# Altium schematic sheet Respiration Sensor.SchDoc
size A4; SPICEModelCacheCCUCSNMB: <root> / <DocumentId>CCUCSNMB</DocumentId> / <CacheFrame Number="0"> / <Model Name="cap" Kind="MDL"> / <Text>*Default semiconductor capacitor / .MODEL CAP C()</Text> / </Model> / <Model Name="1n4004" Kind="MDL"> / <Text>*1N4004 MCE 8-16-95 / *400V 1A Si GenPurpose Diode pkg:DIODE0.4 1,2 / .MODEL 1N4004 D(IS=2.55E-9 RS=0.042 N=1.75 TT=5.76E-6 CJO=1.85E-11 / + VJ=0.75 M=0.333 BV=400 IBV=3.95E-5 )</Text> / </Model> / <Model Name="led3" Kind="MDL"> / <Text>*Typ BLUE SiC LED: Vf=3.4V Vr=5V If=40mA trr=3uS / *LED Pinout: 1=A, 2=K / .MODEL LED3 D (IS=93.1P RS=42M N=7.47 BV=5 IBV=30U / + CJO=2.97P VJ=.75 M=.333 TT=4.32U)</Text> / </Model> / </CacheFrame> / </root>
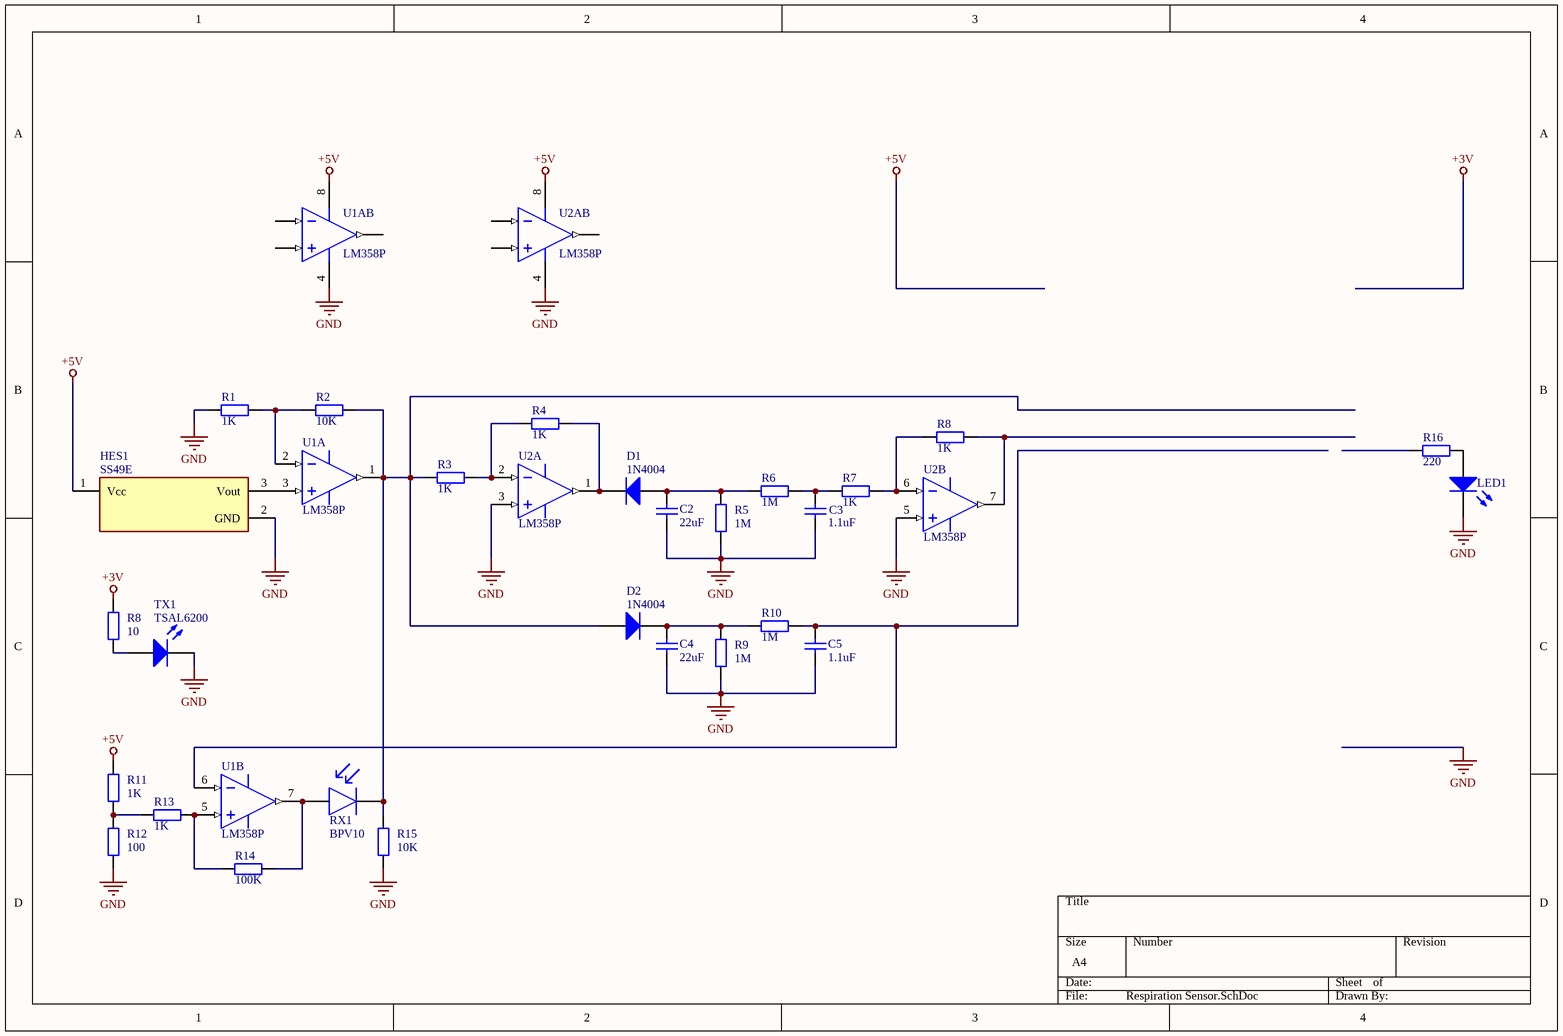
[diagram p0: Respiration Sensor.SchDoc]

## Parts
(Parts that share a designator on the sheet are numbered #1, #2 ... from top to bottom, then left to right.)
C2  value 22uF  [RAD-0.3]  (hidden comment: Cap)
C3  value 1.1uF  [RAD-0.3]  (hidden comment: Cap)
C4  value 22uF  [RAD-0.3]  (hidden comment: Cap)
C5  value 1.1uF  [RAD-0.3]  (hidden comment: Cap)
D1  1N4004  [DO-41]
D2  1N4004  [DO-41]
HES1  SS49E  [FP-SS49E-MFG]
LED1  LED3  [3.5X2.8X1.9]  (value not drawn)
R1  1K  [AXIAL-0.4]
R2  10K  [AXIAL-0.4]
R3  1K  [AXIAL-0.4]
R4  1K  [AXIAL-0.4]
R5  1M  [AXIAL-0.4]
R6  1M  [AXIAL-0.4]
R7  1K  [AXIAL-0.4]
R8#1  1K  [AXIAL-0.4]
R8#2  10  [AXIAL-0.4]
R9  1M  [AXIAL-0.4]
R10  1M  [AXIAL-0.4]
R11  1K  [AXIAL-0.4]
R12  100  [AXIAL-0.4]
R13  1K  [AXIAL-0.4]
R14  100K  [AXIAL-0.4]
R15  10K  [AXIAL-0.4]
R16  220  [AXIAL-0.4]
RX1  BPV10  [FP-6_544-5185_02-4-MFG]
TX1  TSAL6200  [VISH-TSAL6200]
U1  LM358P  [P0008A]  (parts A,B of 2)
U1A  LM358P  [P0008A]  (part B of 2)
U2  LM358P  [P0008A]  (parts A,B of 2)
U2A  LM358P  [P0008A]  (part B of 2)

## Nets
+3V: R8#2.2
+5V: HES1.1(Vcc) R11.2 U1A.8(VCC) U2A.8(VCC)
GND: C2.1 C3.1 C4.1 C5.1 HES1.2(GND) LED1.2(K) R1.1 R5.1 R9.1 R12.1 R15.1 TX1.2(K) U1A.4(GND) U2.3(1IN+) U2.5(2IN+) U2A.4(GND)
NetC2_2: C2.2 D1.1(A) R5.2 R6.1
NetC3_2: C3.2 R6.2 R7.1
NetC4_2: C4.2 D2.2(K) R9.2 R10.1
NetC5_2: C5.2 R10.2 U1.6(2IN-)
NetD1_2: D1.2(K) R4.2 U2.1(1OUT)
NetD2_1: D2.1(A) R2.2 R3.1 R15.2 RX1.1(C) U1.1(1OUT)
NetHES1_3: HES1.3(Vout) U1.3(1IN+)
NetLED1_1: LED1.1(A) R16.2
NetR1_2: R1.2 R2.1 U1.2(1IN-)
NetR3_2: R3.2 R4.1 U2.2(1IN-)
NetR7_2: R7.2 R8#1.1 U2.6(2IN-)
NetR8#1_2: R8#1.2 U2.7(2OUT)
NetR8#2_1: R8#2.1 TX1.1(A)
NetR11_1: R11.1 R12.2 R13.1
NetR13_2: R13.2 R14.1 U1.5(2IN+)
NetR14_2: R14.2 RX1.2(A) U1.7(2OUT)

Not connected (* = marked no-connect by the designer): R16 1; U1A 5(2IN+) 6(2IN-) 7(2OUT); U2A 5(2IN+) 6(2IN-) 7(2OUT)

## Library data of the parts
C2-C5 = Cap: Capacitor; Published: 8-Jun-2000; LatestRevisionDate: 17-Jul-2002; LatestRevisionNote: Re-released for DXP Platform.; PackageReference: RAD-0.3; Publisher: Altium Limited; PackageDescription: Radial Cap, Thru-Hole; 2 Leads; 0.3 in Pin Spacing
D1 D2 = Diode 1N4004: 1 Amp General Purpose Rectifier; Published: 8-Jun-2000; LatestRevisionDate: 17-Jul-2002; LatestRevisionNote: Re-released for DXP Platform.; DatasheetVersion: 1998; PackageVersion: Aug-1999; PackageReference: DO-41; Publisher: Altium Limited; PackageDescription: Diode, Axial; Body 5.2 x 2.7 mm (LxDia. max), Lead Dia. 0.86 mm (max); Code_JEDEC: DO-204-AL; ComponentLink1Description: Manufacturer Link; ComponentLink1URL: http://www.fairchildsemi.com/; ComponentLink2Description: Datasheet; ComponentLink2URL: http://www.fairchildsemi.com/ds/1N%2F1N4001.pdf
HES1 = CMP-11168-000005-1: SENSOR LINEAR ANALOG RADIAL; Min Supply Voltage: 2.7V; Switching Current: 1.5mA; Input Current: 10mA; Min Supply Voltage (DC): 4V; Max Supply Voltage: 6.5V; Operating Supply Current: 6mA; Output Voltage: 1.75mV; Max Supply Voltage (DC): 10V; Leakage Current: 10uA; Response Time: 3us; Package Quantity: 1000; Output Type: Analog; Output Current: 1.5mA; Radiation Hardening: No; Termination: PC Pin; Series: SS49E; RoHS Compliant: Yes; Type: Integrated Circuit (IC); Lead Free: Lead Free; Width: 1.6mm; Length: 4.1mm; Nominal Supply Current: 10mA; Max Operating Temperature: 150°C; Max Output Current: 10mA; Mount: Through Hole; Packaging: Bulk; Case/Package: TO-226-3; Min Operating Temperature: -40°C; Height: 4.1mm; Number of Pins: 3
LED1 = LED3: Typical BLUE SiC LED; Published: 8-Jun-2000; LatestRevisionDate: 17-Dec-2003; LatestRevisionNote: PCB Footprint replaced.; DatasheetVersion: 16-Apr-2002; PackageVersion: 16-Apr-2002; PackageReference: 3.5X2.8X1.9; Publisher: Altium Limited; PackageDescription: SM LED; 2 C-Bend Leads; Body 3.5 x 2.8 x 1.9 mm, inc leads (LxWxH typ)
R1-R7 R8#1 R8#2 R9-R16 = Res2: Resistor; Published: 8-Jun-2000; LatestRevisionDate: 17-Jul-2002; LatestRevisionNote: Re-released for DXP Platform.; PackageReference: AXIAL-0.4; Publisher: Altium Limited; PackageDescription: Axial Device, Thru-Hole; 2 Leads; 0.4 in Pin Spacing
RX1 = CMP-02531-000005-1: SENSOR PHOTODIODE 940NM RADIAL; Manufacturer: Vishay; Standoff Height: 2.6mm; Wavelength: 920nm; Response Time: 2.5ns; Power Dissipation: 215mW; Reverse Breakdown Voltage: 60V; Forward Voltage: 1V; Viewing Angle: 40°; Forward Current: 50mA; Dark Current: 0.001uA; Max Junction Temp: +100°C; Device Class L3: Photodiodes; Manufacturer Part Number: BPV10; RoHS: TRUE; Digikey Description: SENSOR PHOTODIODE 940NM RADIAL; Device Class L1: Sensors; Package: 6.544-5185.02-4; Temperature Range High: +100°C; Sensor Output: Photodiode; Temperature Range Low: -40°C; Height: 12.1mm; Lead Free: Yes; Automotive: No; ComponentLink2Description: Datasheet; Device Class L2: Optical Sensors; ComponentLink2URL: http://www.vishay.com/docs/81502/bpv10.pdf; Octopart: https://octopart.com/bpv10-vishay-39728465; Ambient Temperature Range Low: -40°C; Category: Diode; Temperature: -40°C to +100°C; Mouser Description: Photodiodes 10V 215mW 875nm; Ambient Temperature Range High: +100°C
TX1 = CMP-2000-07327-1: High Power Infrared Emitting Diode, GaAlAs, MQW, 1.35 V, 100 mA, -40 to 85 degC, 2-Pin THD, RoHS, Bulk; Manufacturer: Vishay; Lum Intensity: 500mW/srmcd; Product Depth (mm): 5.8mm; Luminous Intensity: 500mW/sr; Forward Voltage: 3V; Main Category: IrLED; Shape Type: Circular; Peak Wavelength: 950nm; Rad Hardened: No; Product Height (mm): 8.7mm; Number of  Elements: 1; Forward Current: 100mA; High Brightness: Yes; Reverse Voltage: 5V; DELETED: Compliant; Power Dissipation: 160W; Viewing Angle: 34deg; Lens Type: Colored; Packaging: Bulk; Lens Dimensions: 5x5x7.7mm; Type: IrLED; Package Reference: TSAL6200; Chip Material: GaAlAs; Package Description: 2-Pin Through Hole Device, Dia 5.8 mm, Pitch 2.54 mm; Manufacturer URL: http://www.vishay.com/; Product Length (mm): 5.8mm; Datasheet URL: http://www.vishay.com/docs/81010/tsal6200.pdf; Operating Temperature Classification: Industrial; Package Type: T-13/4; Pin Count: 2; Mounting: ThroughHole; Mounting Technology: ThroughHole; Test Current (It): 100mA; Datasheet Version: Rev. 2.4, 03/2014; Operating Temp Range: -40Cto85C
U1 U1A U2 U2A = CMP-2000-06549-1: Dual Operational Amplifier, 3 to 32 V, 0 to 70 degC, 8-Pin PDIP (P), RoHS, Tape and Reel; Manufacturer: Technik Industrial; Datasheet Version: Rev. T, 04/2015; Datasheet URL: http://www.ti.com/lit/ds/symlink/lm358.pdf; Manufacturer URL: http://www.technik.com.hk/; Package Description: 8-Pin Double In-line Package, Body 9.59 x 6.35 mm, Pitch 2.54 mm; Mounting Technology: ThroughHole; Package URL: http://www.ti.com/lit/ml/mpdi001b/mpdi001b.pdf; Package Reference: P8